# Altium schematic sheet Battery level meter.SchDoc
size A
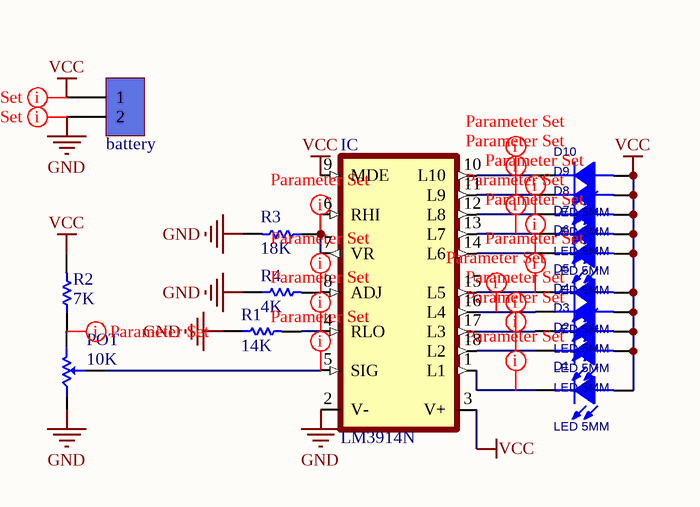
[diagram p0: Battery level meter.SchDoc]

## Parts
battery  KF301_Terminal  [KF301 2PIN]  (value not drawn)
D1  LED 5MM  [LED5MM_RED]
D2  LED 5MM  [LED5MM_RED]
D3  LED 5MM  [LED5MM_RED]
D4  LED 5MM  [LED5MM_RED]
D5  LED 5MM  [LED5MM_YELLOW]
D6  LED 5MM  [LED5MM_YELLOW]
D7  LED 5MM  [LED5MM_YELLOW]
D8  LED 5MM  [LED5MM_YELLOW]
D9  LED 5MM  [LED5MM_GRN]
D10  LED 5MM  [LED5MM_GRN]
IC  LM3914N  [DIL18]
POT  10K  [POT 4]
R1  14K  [RES-(1/1)]
R2  7K  [RES-(1/1)]
R3  18K  [RES-(1/1)]
R4  4K  [RES-(1/1)]

## Nets
GND: battery.2 IC.2(V-) POT.1(CCW) R1.1 R3.2 R4.1
VCC: battery.1 D1.1(ANODE) D2.1(ANODE) D3.1(ANODE) D4.1(ANODE) D5.1(ANODE) D6.1(ANODE) D7.1(ANODE) D8.1(ANODE) D9.1(ANODE) D10.1(ANODE) IC.3(V+) IC.9(MDE) R2.2
NetD1_2: D1.2(CATHODE) IC.1(L1)
NetD2_2: D2.2(CATHODE) IC.18(L2)
NetD3_2: D3.2(CATHODE) IC.17(L3)
NetD4_2: D4.2(CATHODE) IC.16(L4)
NetD5_2: D5.2(CATHODE) IC.15(L5)
NetD6_2: D6.2(CATHODE) IC.14(L6)
NetD7_2: D7.2(CATHODE) IC.13(L7)
NetD8_2: D8.2(CATHODE) IC.12(L8)
NetD9_2: D9.2(CATHODE) IC.11(L9)
NetD10_2: D10.2(CATHODE) IC.10(L10)
NetIC_4: IC.4(RLO) R1.2
NetIC_5: IC.5(SIG) POT.3(SetPoint)
NetIC_6: IC.6(RHI) IC.7(VR) R3.1
NetIC_8: IC.8(ADJ) R4.2
NetPOT_2: POT.2(CW) R2.1

## Layout directives
rule Width Constraint [Pref Width = 118.11mil    Min Width = 118.11mil    Max Width = 118.11mil]: GND
rule Width Constraint [Pref Width = 78.74mil    Min Width = 78.74mil    Max Width = 78.74mil]: VCC
rule Width Constraint [Pref Width = 39.37mil    Min Width = 39.37mil    Max Width = 39.37mil]: NetD1_2, NetD2_2, NetD3_2, NetD4_2, NetD5_2, NetD6_2, NetD7_2, NetD8_2, NetD9_2, NetD10_2, NetIC_4, NetIC_5, NetIC_6, NetIC_8, NetPOT_2

## Library data of the parts
battery = KF301-2Pin_Terminal: Terminal 2 Pin 250VAC 16A; Part. No: KF301 2P; Designer: Abbas Basereh; Link: https://www.aliexpress.com/item/
D1-D10 = LED 5MM: Light Emitting Diode; Designer: Abbas Basereh; Data: 16-12-2016; Link: *; Part.No: *
IC = LM3914N: LED Lighting Drivers; MF: Texas Instruments; MP: LM3914N; Package: None; Price: None; Availability: Unavailable; Value: *; SnapEDA_Link: https://www.snapeda.com/parts/LM3914N/Texas%20Instruments/view-part/4652973/?ref=snap
POT = POT: Variable Resistor; Value: 10K
R1-R4 = RES DIP PACKAGE: TOTAL DIP RESISTOR PACK; Designer: Ali Hafizi